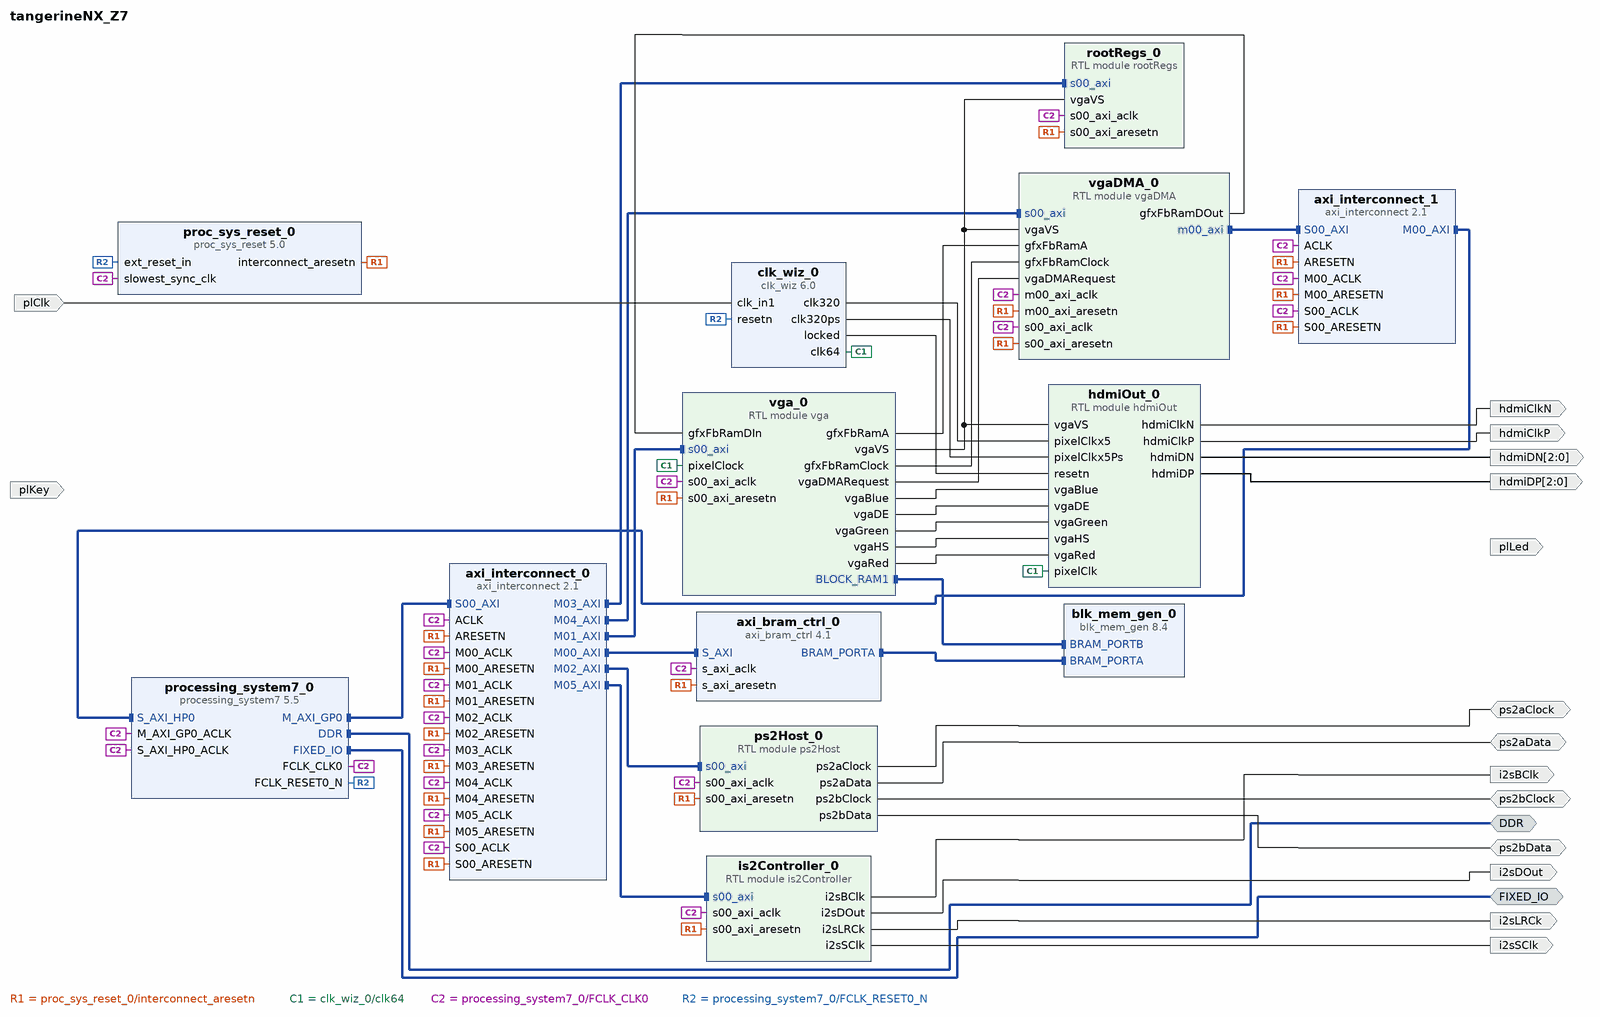
[diagram p0: block diagram of the top level]
# Vivado block design tangerineNX_Z7, xc7z020clg484-1, Vivado 2023.1
create_bd_design tangerineNX_Z7

create_bd_intf_port -mode Master -vlnv xilinx.com:interface:ddrx_rtl:1.0 DDR
create_bd_intf_port -mode Master -vlnv xilinx.com:display_processing_system7:fixedio_rtl:1.0 FIXED_IO
create_bd_port -dir I plKey
create_bd_port -dir O plLed
create_bd_port -dir I plClk
create_bd_port -dir O hdmiClkP
create_bd_port -dir O hdmiClkN
create_bd_port -dir O -from 2 -to 0 hdmiDP
create_bd_port -dir O -from 2 -to 0 hdmiDN
create_bd_port -dir IO ps2aClock
create_bd_port -dir IO ps2aData
create_bd_port -dir IO ps2bClock
create_bd_port -dir IO ps2bData
create_bd_port -dir O i2sSClk
create_bd_port -dir O i2sBClk
create_bd_port -dir O i2sLRCk
create_bd_port -dir O i2sDOut

create_bd_cell -type ip -vlnv xilinx.com:ip:processing_system7:5.5 processing_system7_0
set_property -dict [list \
  CONFIG.PCW_ENET0_ENET0_IO {MIO 16 .. 27} \
  CONFIG.PCW_ENET0_GRP_MDIO_ENABLE 1 \
  CONFIG.PCW_ENET0_GRP_MDIO_IO {MIO 52 .. 53} \
  CONFIG.PCW_ENET0_PERIPHERAL_ENABLE 1 \
  CONFIG.PCW_ENET0_RESET_ENABLE 0 \
  CONFIG.PCW_ENET_RESET_ENABLE 1 \
  CONFIG.PCW_ENET_RESET_SELECT {Share reset pin} \
  CONFIG.PCW_FPGA0_PERIPHERAL_FREQMHZ 100 \
  CONFIG.PCW_GPIO_MIO_GPIO_ENABLE 1 \
  CONFIG.PCW_GPIO_MIO_GPIO_IO MIO \
  CONFIG.PCW_I2C_RESET_ENABLE 1 \
  CONFIG.PCW_PRESET_BANK1_VOLTAGE {LVCMOS 1.8V} \
  CONFIG.PCW_SD0_GRP_CD_ENABLE 1 \
  CONFIG.PCW_SD0_GRP_CD_IO {MIO 47} \
  CONFIG.PCW_SD0_GRP_WP_ENABLE 0 \
  CONFIG.PCW_SD0_PERIPHERAL_ENABLE 1 \
  CONFIG.PCW_SD0_SD0_IO {MIO 40 .. 45} \
  CONFIG.PCW_SDIO_PERIPHERAL_FREQMHZ 100 \
  CONFIG.PCW_UART0_PERIPHERAL_ENABLE 1 \
  CONFIG.PCW_UART0_UART0_IO {MIO 14 .. 15} \
  CONFIG.PCW_UART_PERIPHERAL_FREQMHZ 100 \
  CONFIG.PCW_UIPARAM_DDR_BUS_WIDTH {16 Bit} \
  CONFIG.PCW_UIPARAM_DDR_PARTNO {MT41K256M16 RE-125} \
  CONFIG.PCW_USB0_PERIPHERAL_ENABLE 1 \
  CONFIG.PCW_USB0_RESET_ENABLE 0 \
  CONFIG.PCW_USB0_USB0_IO {MIO 28 .. 39} \
  CONFIG.PCW_USB_RESET_ENABLE 1 \
  CONFIG.PCW_USB_RESET_SELECT {Share reset pin} \
  CONFIG.PCW_USE_S_AXI_HP0 1 \
] [get_bd_cells processing_system7_0]
# 216 more settings of processing_system7_0 are not shown: defaults, MIO pin electricals, DDR timing, and values the tool derives
create_bd_cell -type ip -vlnv xilinx.com:ip:proc_sys_reset:5.0 proc_sys_reset_0
create_bd_cell -type ip -vlnv xilinx.com:ip:axi_interconnect:2.1 axi_interconnect_0
set_property -dict {CONFIG.NUM_MI 6} [get_bd_cells axi_interconnect_0]
create_bd_cell -type ip -vlnv xilinx.com:ip:axi_bram_ctrl:4.1 axi_bram_ctrl_0
set_property -dict {CONFIG.SINGLE_PORT_BRAM 1} [get_bd_cells axi_bram_ctrl_0]
create_bd_cell -type ip -vlnv xilinx.com:ip:blk_mem_gen:8.4 blk_mem_gen_0
set_property -dict {CONFIG.Memory_Type True_Dual_Port_RAM} [get_bd_cells blk_mem_gen_0]
create_bd_cell -type ip -vlnv xilinx.com:ip:clk_wiz:6.0 clk_wiz_0
set_property -dict [list \
  CONFIG.CLKIN1_JITTER_PS 200.0 \
  CONFIG.CLKOUT1_JITTER 651.823 \
  CONFIG.CLKOUT1_PHASE_ERROR 919.522 \
  CONFIG.CLKOUT1_REQUESTED_OUT_FREQ 64 \
  CONFIG.CLKOUT2_JITTER 523.758 \
  CONFIG.CLKOUT2_PHASE_ERROR 919.522 \
  CONFIG.CLKOUT2_REQUESTED_OUT_FREQ 320 \
  CONFIG.CLKOUT2_USED true \
  CONFIG.CLKOUT3_JITTER 523.758 \
  CONFIG.CLKOUT3_PHASE_ERROR 919.522 \
  CONFIG.CLKOUT3_REQUESTED_OUT_FREQ 320 \
  CONFIG.CLKOUT3_REQUESTED_PHASE 180 \
  CONFIG.CLKOUT3_USED true \
  CONFIG.CLK_OUT1_PORT clk64 \
  CONFIG.CLK_OUT2_PORT clk320 \
  CONFIG.CLK_OUT3_PORT clk320ps \
  CONFIG.MMCM_CLKFBOUT_MULT_F 64.000 \
  CONFIG.MMCM_CLKIN1_PERIOD 20.000 \
  CONFIG.MMCM_CLKIN2_PERIOD 10.0 \
  CONFIG.MMCM_CLKOUT0_DIVIDE_F 10.000 \
  CONFIG.MMCM_CLKOUT1_DIVIDE 2 \
  CONFIG.MMCM_CLKOUT2_DIVIDE 2 \
  CONFIG.MMCM_CLKOUT2_PHASE 180.000 \
  CONFIG.MMCM_DIVCLK_DIVIDE 5 \
  CONFIG.NUM_OUT_CLKS 3 \
  CONFIG.PRIM_IN_FREQ 50 \
  CONFIG.RESET_PORT resetn \
  CONFIG.RESET_TYPE ACTIVE_LOW \
] [get_bd_cells clk_wiz_0]
create_bd_cell -type module -reference hdmiOut hdmiOut_0
create_bd_cell -type module -reference vga vga_0
create_bd_cell -type module -reference ps2Host ps2Host_0
create_bd_cell -type ip -vlnv xilinx.com:ip:axi_interconnect:2.1 axi_interconnect_1
set_property -dict {CONFIG.ENABLE_ADVANCED_OPTIONS 1 CONFIG.NUM_MI 1 CONFIG.XBAR_DATA_WIDTH 64} [get_bd_cells axi_interconnect_1]
create_bd_cell -type module -reference vgaDMA vgaDMA_0
create_bd_cell -type module -reference rootRegs rootRegs_0
create_bd_cell -type module -reference is2Controller is2Controller_0

# ---- connections ----

connect_bd_intf_net [get_bd_intf_pins axi_bram_ctrl_0/BRAM_PORTA] [get_bd_intf_pins blk_mem_gen_0/BRAM_PORTA]
connect_bd_intf_net [get_bd_intf_pins axi_interconnect_0/M00_AXI] [get_bd_intf_pins axi_bram_ctrl_0/S_AXI]
connect_bd_intf_net [get_bd_intf_pins vga_0/s00_axi] [get_bd_intf_pins axi_interconnect_0/M01_AXI]
connect_bd_intf_net [get_bd_intf_pins ps2Host_0/s00_axi] [get_bd_intf_pins axi_interconnect_0/M02_AXI]
connect_bd_intf_net [get_bd_intf_pins rootRegs_0/s00_axi] [get_bd_intf_pins axi_interconnect_0/M03_AXI]
connect_bd_intf_net [get_bd_intf_pins axi_interconnect_0/M04_AXI] [get_bd_intf_pins vgaDMA_0/s00_axi]
connect_bd_intf_net [get_bd_intf_pins is2Controller_0/s00_axi] [get_bd_intf_pins axi_interconnect_0/M05_AXI]
connect_bd_intf_net [get_bd_intf_pins axi_interconnect_1/M00_AXI] [get_bd_intf_pins processing_system7_0/S_AXI_HP0]
connect_bd_intf_net [get_bd_intf_ports DDR] [get_bd_intf_pins processing_system7_0/DDR]
connect_bd_intf_net [get_bd_intf_ports FIXED_IO] [get_bd_intf_pins processing_system7_0/FIXED_IO]
connect_bd_intf_net [get_bd_intf_pins processing_system7_0/M_AXI_GP0] [get_bd_intf_pins axi_interconnect_0/S00_AXI]
connect_bd_intf_net [get_bd_intf_pins vgaDMA_0/m00_axi] [get_bd_intf_pins axi_interconnect_1/S00_AXI]
connect_bd_intf_net [get_bd_intf_pins vga_0/BLOCK_RAM1] [get_bd_intf_pins blk_mem_gen_0/BRAM_PORTB]
connect_bd_net -net ARESETN_1 [get_bd_pins proc_sys_reset_0/interconnect_aresetn] \
  [get_bd_pins axi_interconnect_0/ARESETN] [get_bd_pins axi_interconnect_0/S00_ARESETN] \
  [get_bd_pins axi_interconnect_0/M00_ARESETN] [get_bd_pins axi_interconnect_0/M01_ARESETN] \
  [get_bd_pins axi_bram_ctrl_0/s_axi_aresetn] [get_bd_pins axi_interconnect_0/M02_ARESETN] \
  [get_bd_pins ps2Host_0/s00_axi_aresetn] [get_bd_pins vga_0/s00_axi_aresetn] [get_bd_pins axi_interconnect_0/M03_ARESETN] \
  [get_bd_pins axi_interconnect_1/ARESETN] [get_bd_pins axi_interconnect_1/S00_ARESETN] \
  [get_bd_pins axi_interconnect_1/M00_ARESETN] [get_bd_pins axi_interconnect_0/M04_ARESETN] \
  [get_bd_pins vgaDMA_0/s00_axi_aresetn] [get_bd_pins vgaDMA_0/m00_axi_aresetn] [get_bd_pins rootRegs_0/s00_axi_aresetn] \
  [get_bd_pins is2Controller_0/s00_axi_aresetn] [get_bd_pins axi_interconnect_0/M05_ARESETN]
connect_bd_net [get_bd_ports ps2aClock] [get_bd_pins ps2Host_0/ps2aClock]
connect_bd_net [get_bd_ports ps2aData] [get_bd_pins ps2Host_0/ps2aData]
connect_bd_net [get_bd_ports ps2bClock] [get_bd_pins ps2Host_0/ps2bClock]
connect_bd_net [get_bd_ports ps2bData] [get_bd_pins ps2Host_0/ps2bData]
connect_bd_net [get_bd_pins clk_wiz_0/clk64] [get_bd_pins hdmiOut_0/pixelClk] [get_bd_pins vga_0/pixelClock]
connect_bd_net [get_bd_pins clk_wiz_0/clk320] [get_bd_pins hdmiOut_0/pixelClkx5]
connect_bd_net [get_bd_pins clk_wiz_0/clk320ps] [get_bd_pins hdmiOut_0/pixelClkx5Ps]
connect_bd_net [get_bd_pins clk_wiz_0/locked] [get_bd_pins hdmiOut_0/resetn]
connect_bd_net [get_bd_pins hdmiOut_0/hdmiClkN] [get_bd_ports hdmiClkN]
connect_bd_net [get_bd_pins hdmiOut_0/hdmiClkP] [get_bd_ports hdmiClkP]
connect_bd_net [get_bd_pins hdmiOut_0/hdmiDN] [get_bd_ports hdmiDN]
connect_bd_net [get_bd_pins hdmiOut_0/hdmiDP] [get_bd_ports hdmiDP]
connect_bd_net [get_bd_pins is2Controller_0/i2sBClk] [get_bd_ports i2sBClk]
connect_bd_net [get_bd_pins is2Controller_0/i2sDOut] [get_bd_ports i2sDOut]
connect_bd_net [get_bd_pins is2Controller_0/i2sLRCk] [get_bd_ports i2sLRCk]
connect_bd_net [get_bd_pins is2Controller_0/i2sSClk] [get_bd_ports i2sSClk]
connect_bd_net [get_bd_ports plClk] [get_bd_pins clk_wiz_0/clk_in1]
connect_bd_net [get_bd_pins processing_system7_0/FCLK_CLK0] \
  [get_bd_pins processing_system7_0/M_AXI_GP0_ACLK] [get_bd_pins processing_system7_0/S_AXI_HP0_ACLK] \
  [get_bd_pins proc_sys_reset_0/slowest_sync_clk] [get_bd_pins axi_interconnect_0/ACLK] \
  [get_bd_pins axi_interconnect_0/S00_ACLK] [get_bd_pins axi_interconnect_0/M00_ACLK] \
  [get_bd_pins axi_interconnect_0/M01_ACLK] [get_bd_pins axi_bram_ctrl_0/s_axi_aclk] \
  [get_bd_pins axi_interconnect_0/M02_ACLK] [get_bd_pins ps2Host_0/s00_axi_aclk] [get_bd_pins vga_0/s00_axi_aclk] \
  [get_bd_pins axi_interconnect_0/M03_ACLK] [get_bd_pins axi_interconnect_1/ACLK] [get_bd_pins axi_interconnect_1/S00_ACLK] \
  [get_bd_pins axi_interconnect_1/M00_ACLK] [get_bd_pins axi_interconnect_0/M04_ACLK] [get_bd_pins vgaDMA_0/s00_axi_aclk] \
  [get_bd_pins vgaDMA_0/m00_axi_aclk] [get_bd_pins rootRegs_0/s00_axi_aclk] [get_bd_pins is2Controller_0/s00_axi_aclk] \
  [get_bd_pins axi_interconnect_0/M05_ACLK]
connect_bd_net [get_bd_pins processing_system7_0/FCLK_RESET0_N] [get_bd_pins proc_sys_reset_0/ext_reset_in] [get_bd_pins clk_wiz_0/resetn]
connect_bd_net [get_bd_pins vgaDMA_0/gfxFbRamDOut] [get_bd_pins vga_0/gfxFbRamDIn]
connect_bd_net [get_bd_pins vga_0/gfxFbRamA] [get_bd_pins vgaDMA_0/gfxFbRamA]
connect_bd_net [get_bd_pins vga_0/gfxFbRamClock] [get_bd_pins vgaDMA_0/gfxFbRamClock]
connect_bd_net [get_bd_pins vga_0/vgaBlue] [get_bd_pins hdmiOut_0/vgaBlue]
connect_bd_net [get_bd_pins vga_0/vgaDE] [get_bd_pins hdmiOut_0/vgaDE]
connect_bd_net [get_bd_pins vga_0/vgaDMARequest] [get_bd_pins vgaDMA_0/vgaDMARequest]
connect_bd_net [get_bd_pins vga_0/vgaGreen] [get_bd_pins hdmiOut_0/vgaGreen]
connect_bd_net [get_bd_pins vga_0/vgaHS] [get_bd_pins hdmiOut_0/vgaHS]
connect_bd_net [get_bd_pins vga_0/vgaRed] [get_bd_pins hdmiOut_0/vgaRed]
connect_bd_net [get_bd_pins vga_0/vgaVS] [get_bd_pins hdmiOut_0/vgaVS] [get_bd_pins vgaDMA_0/vgaVS] [get_bd_pins rootRegs_0/vgaVS]
set_property HDL_ATTRIBUTE.BMM_INFO_PROCESSOR {arm > tangerineNX_Z7 axi_bram_ctrl_0} [get_bd_cells processing_system7_0]
set_property HDL_ATTRIBUTE.KEEP_HIERARCHY yes [get_bd_cells processing_system7_0]
set_property HDL_ATTRIBUTE.BMM_INFO_ADDRESS_SPACE {byte  0x40000000 32 > tangerineNX_Z7 blk_mem_gen_0} [get_bd_cells axi_bram_ctrl_0]
set_property HDL_ATTRIBUTE.KEEP_HIERARCHY yes [get_bd_cells axi_bram_ctrl_0]

# ---- address map ----
assign_bd_address -offset 0x40000000 -range 32K -target_address_space [get_bd_addr_spaces processing_system7_0/Data] [get_bd_addr_segs axi_bram_ctrl_0/S_AXI/Mem0]
assign_bd_address -offset 0x41000000 -range 4K -target_address_space [get_bd_addr_spaces processing_system7_0/Data] [get_bd_addr_segs rootRegs_0/s00_axi/reg0]
assign_bd_address -offset 0x42000000 -range 4K -target_address_space [get_bd_addr_spaces processing_system7_0/Data] [get_bd_addr_segs vga_0/s00_axi/reg0]
assign_bd_address -offset 0x43000000 -range 4K -target_address_space [get_bd_addr_spaces processing_system7_0/Data] [get_bd_addr_segs ps2Host_0/s00_axi/reg0]
assign_bd_address -offset 0x44000000 -range 4K -target_address_space [get_bd_addr_spaces processing_system7_0/Data] [get_bd_addr_segs vgaDMA_0/s00_axi/reg0]
assign_bd_address -offset 0x45000000 -range 4K -target_address_space [get_bd_addr_spaces processing_system7_0/Data] [get_bd_addr_segs is2Controller_0/s00_axi/reg0]
assign_bd_address -offset 0x00000000 -range 512M -target_address_space [get_bd_addr_spaces vgaDMA_0/m00_axi] [get_bd_addr_segs processing_system7_0/S_AXI_HP0/HP0_DDR_LOWOCM]

validate_bd_design
save_bd_design
